# Altium schematic sheet CountDown LCD-Relay-Sound.SchDoc: CountDown with Relay and 12V output
size A4; Revision: 0; Version: 1.0; Variant: Variant; Modification: Mod; Project: CountDown; PageSetup: Record=PageOptions|CenterHorizontal=True|CenterVertical=True|PrintScale=0.97|XCorrection=1.00|YCorrection=1.00|PrintKind=1|BorderSize=5000000|LeftOffset=0|BottomOffset=0|Orientation=2|PaperLength=2970|PaperWidth=2100|Scale=100|PaperSource=7|PrintQuality=-4|MediaType=1|DitherType=10|PaperKind=A4|PrintScaleMode=1
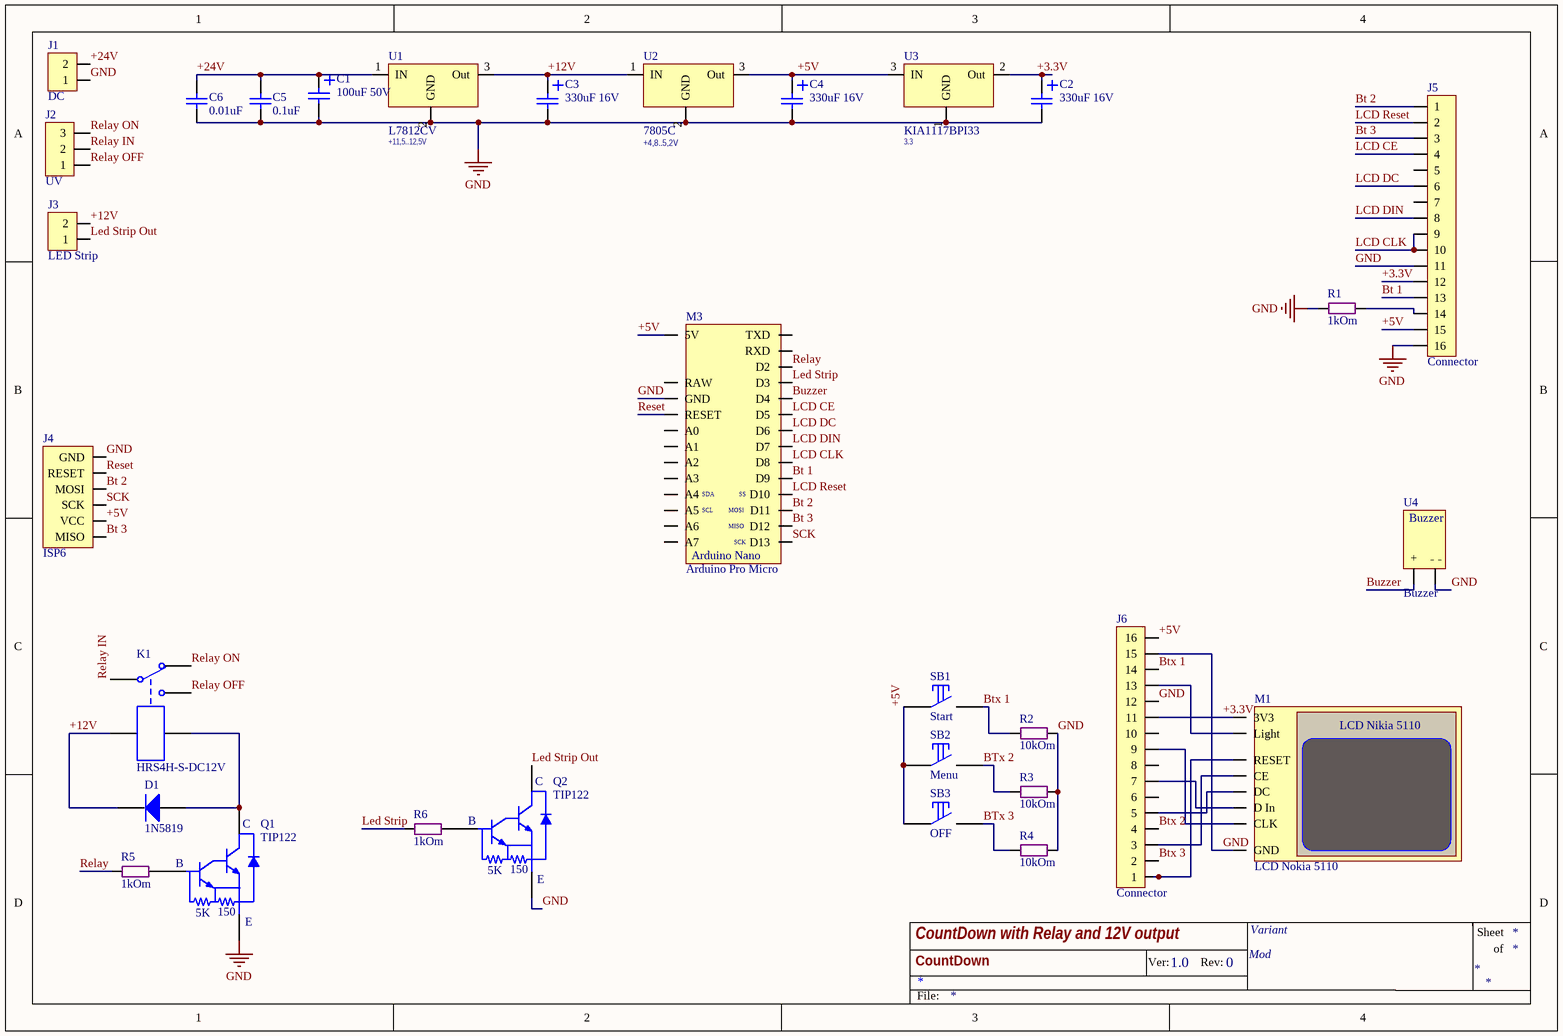
[diagram p0: CountDown LCD-Relay-Sound.SchDoc]

## Parts
C1  100uF 50V  [Cap E p3.5mm D8xH12]
C2  330uF 16V  [Cap E p3.5mm D8xH12]
C3  330uF 16V  [Cap E p3.5mm D8xH12]
C4  330uF 16V  [Cap E p3.5mm D8xH12]
C5  0.1uF  [SMD 0805 (2012)]
C6  0.01uF  [SMD 0805 (2012)]
D1  1N5819  [Diode DO-35]
J1  DC  [DG301 5mm 2p]
J2  UV  [DG301 5mm 3p]
J3  LED Strip  [DG301 5mm 2p]
J4  ISP6  [LINE 2.54 x 6D (2 x 3)]
J5  Connector  [LINE 2.54 x 16D (2 x 8)]
J6  Connector  [LINE 2.54 x 16D (2 x 8)]
K1  HRS4H-S-DC12V  [Relay Type C]
M1  LCD Nokia 5110  [LCD Nokia 5110]
M3  Arduino Pro Micro  [Arduino Pro Mini (no A4-A7))]
Q1  TIP122  [TO220-2 Horisontal]
Q2  TIP122  [TO220-2 Horisontal]
R1  1kOm  [SMD 0805 (2012)]
R2  10kOm  [SMD 0805 (2012)]
R3  10kOm  [SMD 0805 (2012)]
R4  10kOm  [SMD 0805 (2012)]
R5  1kOm  [SMD 0805 (2012)]
R6  1kOm  [SMD 0805 (2012)]
SB1  Start  [Switch Button 4P]
SB2  Menu  [Switch Button 4P]
SB3  OFF  [Switch Button 4P]
U1  L7812CV  V Out: +11,5..12,5V  [TO220-2 Horisontal]
U2  7805C  V Out: +4,8..5,2V  [D-PAK]
U3  KIA1117BPI33  V Out: 3.3  [TO220-2 Horisontal]
U4  Buzzer  [Buzzer 12x9mm]

## Nets
GND: C1.2 C2.2 C3.2 C4.2 C5.2 C6.2 J1.1 J4.6(GND) J5.11 J5.16 J6.12 J6.15 M1.GND M3.GND Q1.3(E) Q2.3(E) R1.1 R2.2 R3.2 R4.2 U1.2(GND) U2.2(GND) U3.1(GND) U4.2(|)
+3.3V: C2.1 J5.12 J6.11 M1.VCC(3V3) U3.2(Out)
+5V: C4.1 J4.2(VCC) J5.15 J6.16 M3.5V SB1.1 SB2.1 SB3.1 U2.3(Out) U3.3(IN)
+12V: C3.1 D1.K J3.2 K1.4 U1.3(Out) U2.1(IN)
+24V: C1.1 C5.1 C6.1 J1.2 U1.1(IN)
Bt 1: J5.13 M3.D9
Bt 2: J4.4(MOSI) J5.1 M3.D11
Bt 3: J4.1(MISO) J5.3 M3.D12
Btx 1: J6.14 R2.1 SB1.2
BTx 2: J6.4 R3.1 SB2.2
BTx 3: J6.2 R4.1 SB3.2
Buzzer: M3.D4 U4.1(+)
LCD CE: J5.4 M3.D5
LCD CLK: J5.9 J5.10 M3.D8
LCD DC: J5.6 M3.D6
LCD DIN: J5.8 M3.D7
LCD Reset: J5.2 M3.D10
Led Strip: M3.D3 R6.1
Led Strip Out: J3.1 Q2.2(C)
Relay: M3.D2 R5.1
Relay IN: J2.2 K1.2
Relay OFF: J2.1 K1.3
Relay ON: J2.3 K1.1
Reset: J4.5(RESET) M3.RESET
SCK: J4.3(SCK) M3.D13
NetD1_A: D1.A K1.5 Q1.2(C)
NetJ5_14: J5.14 R1.2
NetJ6_1: J6.1 M1.RST(RESET)
NetJ6_3: J6.3 M1.CE
NetJ6_5: J6.5 M1.DC
NetJ6_7: J6.7 M1.DIN(D_In)
NetJ6_9: J6.9 M1.CLK
NetJ6_13: J6.13 M1.LIGHT(Light)
NetQ1_1: Q1.1(B) R5.2
NetQ2_1: Q2.1(B) R6.2

Not connected (* = marked no-connect by the designer): J5 5 7; J6 6 8 10; M3 A0 A1 A2 A3 A4 A5 A6 A7 RAW RXD TXD

## Notes on the sheet
- Ver:
- Rev:
- Sheet
- of
- File:
- (in symbol Arduino Pro Micro) SDA; SS; SCL; MOSI; MISO; SCK; Arduino Nano
- (in symbol LCD Nokia 5110) LCD Nikia 5110
- (in symbol TIP122) 5K; 150

## Library data of the parts
C1 = Cap E 100mF x 50V: Capacitor
C2-C4 = Cap E 330uF x 16V: Capacitor
C5 C6 = Cap SMD 0402-1812: Capacitor
D1 = Diode 1N5819: 1 Amp General Purpose Rectifier; PackageReference: DO-41; VALUE: 1N5819
J1 J3 = DG301-5.0-2P12: DG301 series
J2 = DG301-5.0-3P12: DG301 series
J4 = ISP-6 connector PLD6
J5 J6 = PLD-16 (2 x 8): Vert, Dbl line, Male
K1 = HRS4H-S-DC12V: Single-Pole Relay 12V 10A; R обм: 240 Om; Name: HRS4H-S-DC12V; I (DC = 28 V): 10A; I (AC = 240 V): 10A; U: 12 V
Q1 Q2 = TIP122: NPN Darlington 5A, 65W, 100V, h>1000; I imp: 8A; h21e: >1000; Code_JEDEC: TO-220; U max: 100V; I max: 5A; P max: 65W; Channnel: NPN
R1-R6 = Res All Types
SB1-SB3 = Button: Tact button
U1 = L7812CV: Voltage Regulator; Manufacturer: ST; I output (A): 1.5; Max Voltage In (V): 35; t: 0...+150°C; Dropuot: 2V; Case: TO220; Name: L7812CV; Dtatsheet: http://tec.org.ru/board/0-0-0-1633-20
U2 = 7805C: Voltage Regulator; Manufacturer: Интеграл; I output (A): 1; Max Voltage In (V): 35; Напряжение выход-вход (dropout): >2V; t: -10..+70°C; Case: D2PAK; Shema: http://tec.org.ru/_bd/5/57349922.jpg; Name: 7805C
U3 = KIA1117BPI33: Voltage Regulator TO220; Manufacturer: KEC Ltd.; I output (A): 1; Max Voltage In (V): 12; t: -40...+125°C; Dropuot: 1.5V; Capacitors: In: 10uF; Out 10uF Tantal; Case: TO-220; Name: KIA1117BPI33; Dtatsheet: http://tec.org.ru/board/0-0-0-2438-20
U4 = Buzzer: Dallas Digital t Sensor; VCC: 3-5.5v; range: -55...+125 C